# EasyEDA schematic SCH_Personal-Card.json
TITLE: Sheet_1; REV: 1.0; Date: 2024-08-31; Sheet: 1/1; Drawn By: Felix Pfannkuch; Company: Your Company
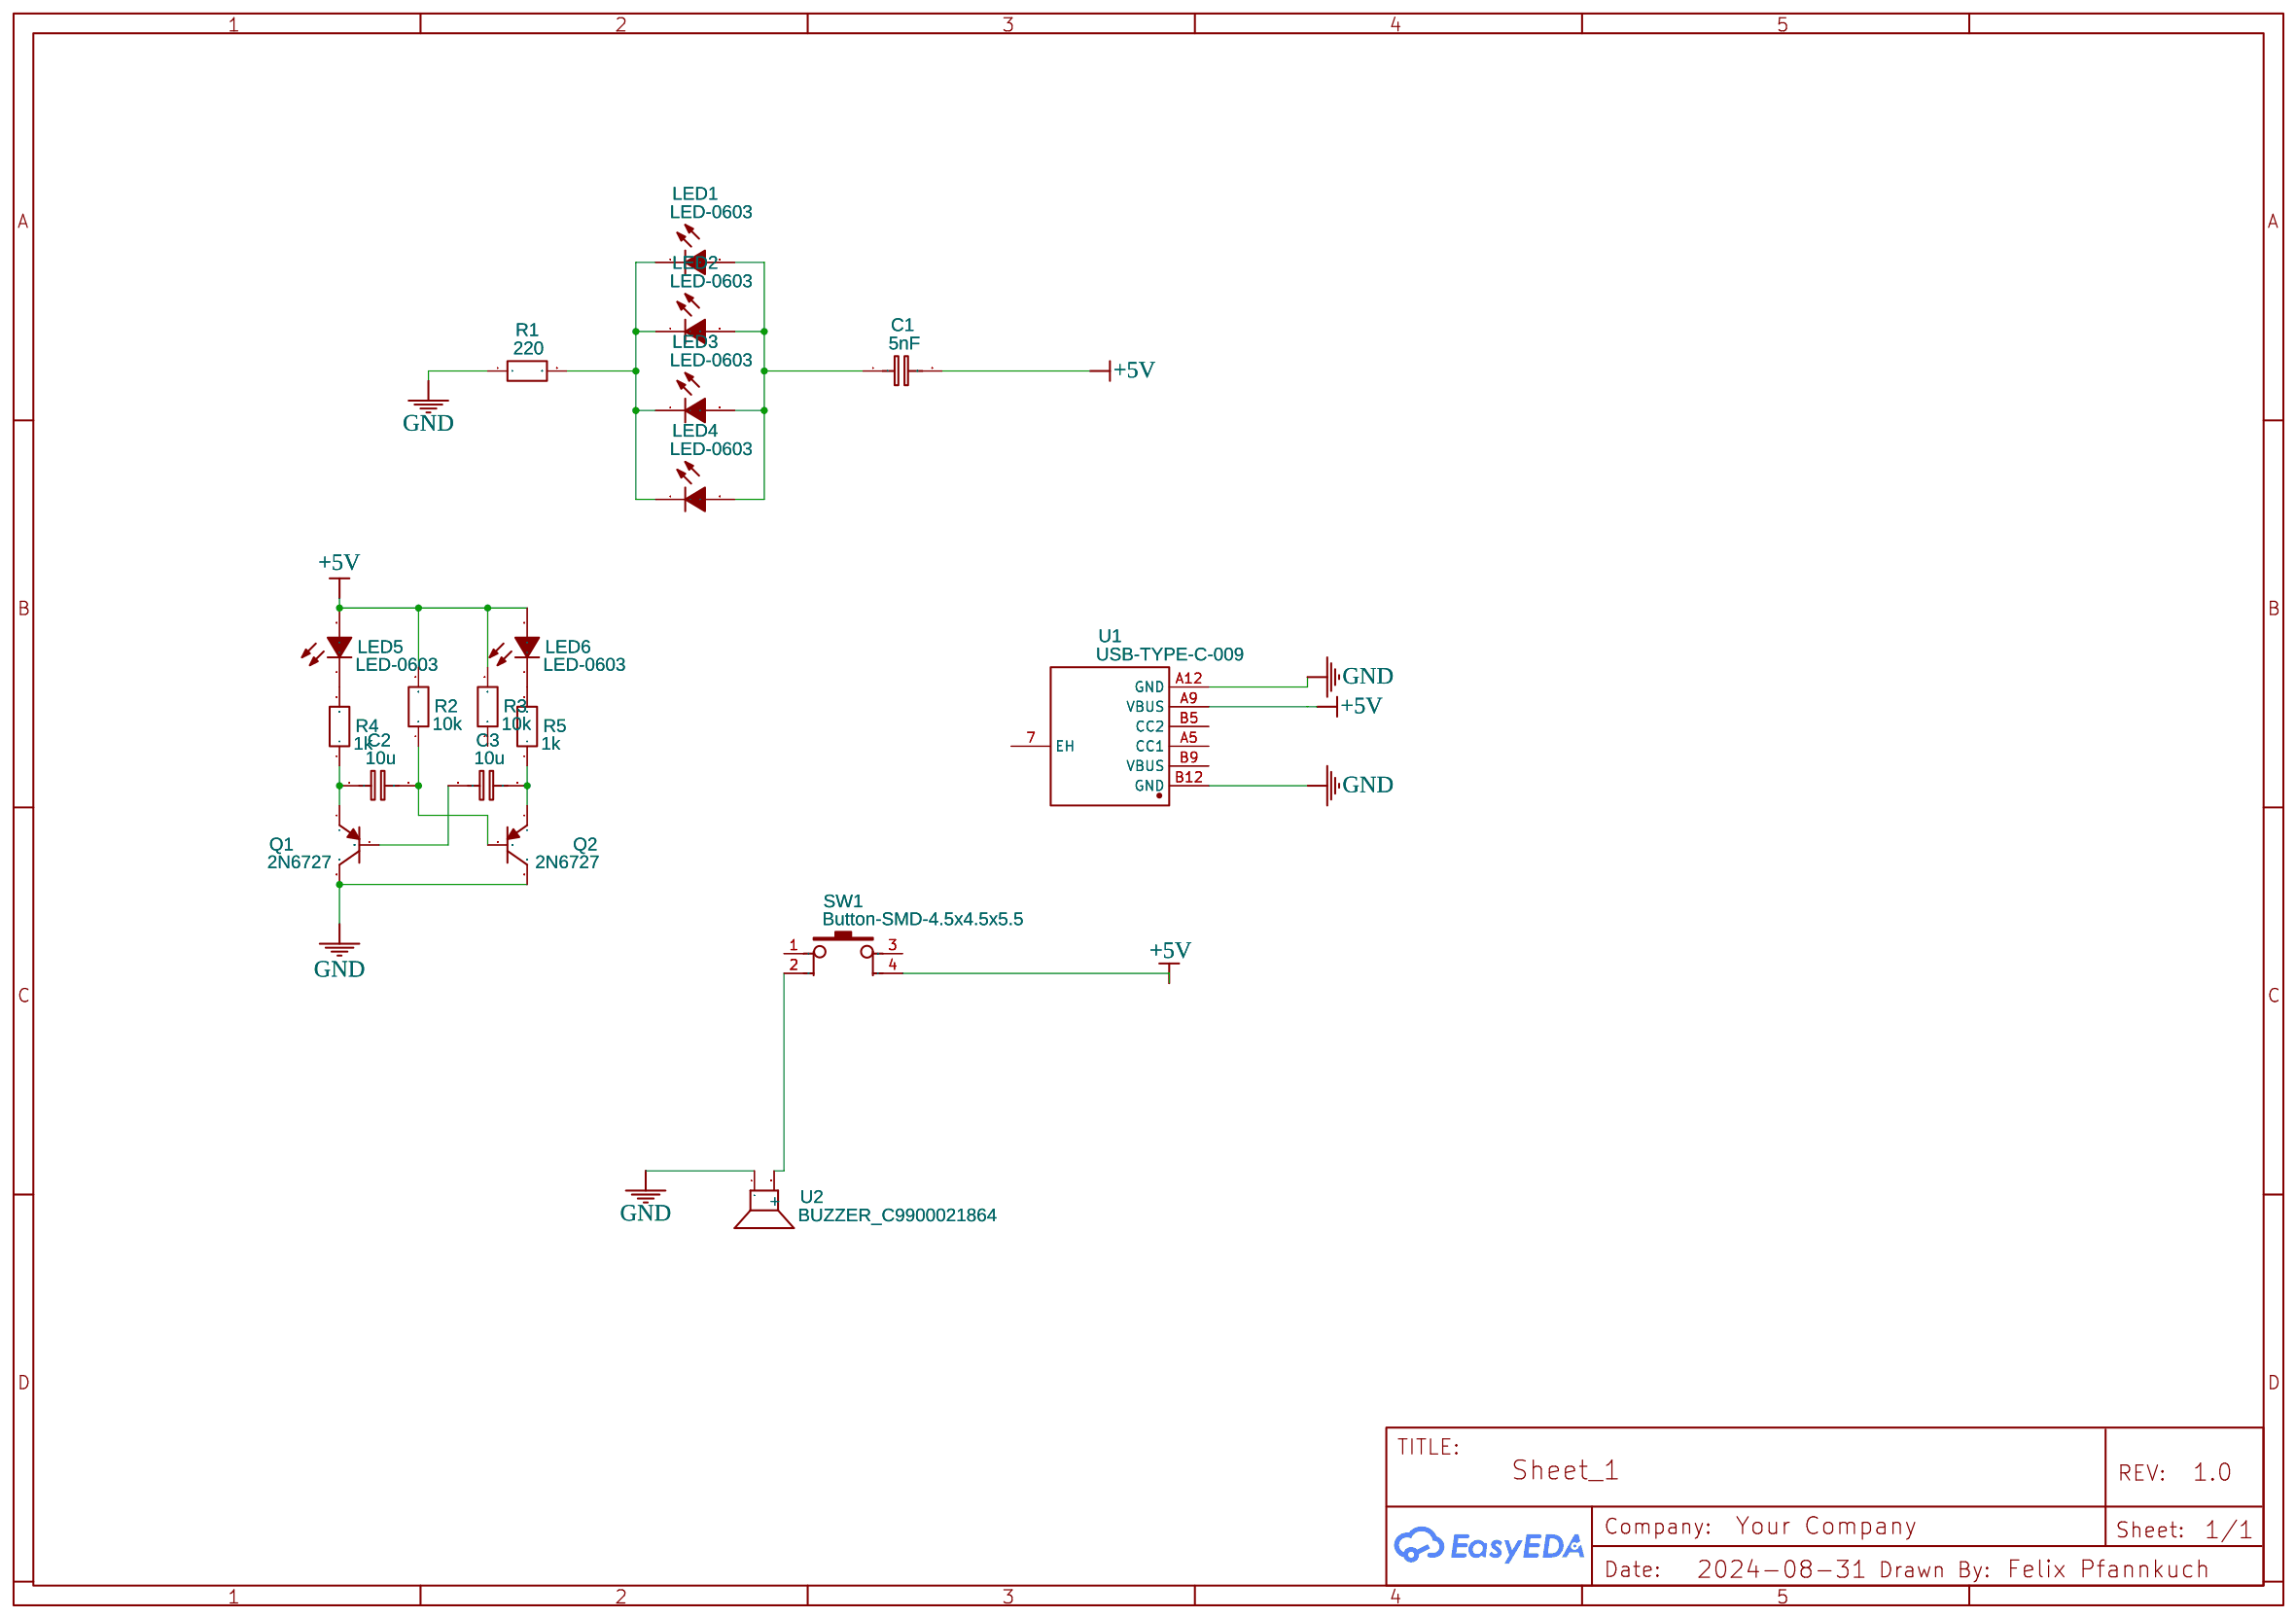
[diagram p0: schematic sheet]

## Parts
C1  5nF  [C0603]
C2  10u  [C0603]
C3  10u  [C0603]
LED1  LED-0603  [LED0603-RD]
LED2  LED-0603  [LED0603-RD]
LED3  LED-0603  [LED0603-RD]
LED4  LED-0603  [LED0603-RD]
LED5  LED-0603  [LED0603-RD]
LED6  LED-0603  [LED0603-RD]
Q1  2N6727  [TO-92-3_L4.9-W3.7-P1.27-L]
Q2  2N6727  [TO-92-3_L4.9-W3.7-P1.27-L]
R1  220  [R0603]
R2  10k  [R0603]
R3  10k  [R0603]
R4  1k  [R0603]
R5  1k  [R0603]
SW1  Button-SMD-4.5x4.5x5.5  [SW-SMD_4P-L4.5-W4.5-P3.00-LS7.0]
U1  USB-TYPE-C-009  [TYPE-C-SMD_TYPE-C-6P]
U2  BUZZER_C9900021864  [BUZ-SMD_BUZZER]

## Library data of the parts
C1-C3 = C_0603_EU: Contributor: LCEDA_Lib
LED1-LED6 = LED-0603: Contributor: lcsc; Supplier: LCSC; Supplier Part: C9900020572; Manufacturer: null; JLCPCB Part Class: Extended Part
Q1 Q2 = 2N6727: Supplier Part: C24961; Supplier: LCSC; Manufacturer: CJ
R1-R5 = R_0603_EU: Contributor: LCEDA_Lib
SW1 = Button-SMD-4.5x4.5x5.5: Supplier Part: C71849; Supplier: LCSC; Manufacturer: BBJ; Manufacturer Part: 4.5*4.5*5.5 Plastic head,260G, 0.25mm,SMD; JLCPCB Part Class: Extended Part
U1 = USB-TYPE-C-009: Contributor: lcsc; Supplier: LCSC; Supplier Part: C2927029; Manufacturer: DEALON(德艺隆); JLCPCB Part Class: Extended Part
U2 = BUZZER_C9900021864: Contributor: lcsc; Supplier: LCSC; Supplier Part: C9900021864; Manufacturer: null; Manufacturer Part: BUZZER; JLCPCB Part Class: Extended Part

## Nets
+5V: C1.2 LED5.2(+) LED6.2(+) R2.2 R3.2 SW1.4 U1.A9(VBUS)
GND: Q1.3(C) Q2.3(C) R1.1 U1.A12(GND) U1.B12(GND) U2.1
Net-(C1-1): C1.1 LED1.2(+) LED2.2(+) LED3.2(+) LED4.2(+)
Net-(C2-1): C2.1 Q1.1(E) R4.1
Net-(C2-2): C2.2 Q2.2(B) R2.1
Net-(C3-1): C3.1 Q1.2(B)
Net-(C3-2): C3.2 Q2.1(E) R5.1
Net-(LED1-1): LED1.1(-) LED2.1(-) LED3.1(-) LED4.1(-) R1.2
Net-(LED5-1): LED5.1(-) R4.2
Net-(LED6-1): LED6.1(-) R5.2
Net-(SW1-2): SW1.2 U2.2(+)

Not connected (* = marked no-connect by the designer): R3 1; SW1 1 3; U1 7(EH) A5(CC1) B5(CC2) B9(VBUS)
